# Altium project E17-12-VCU.PrjPcb
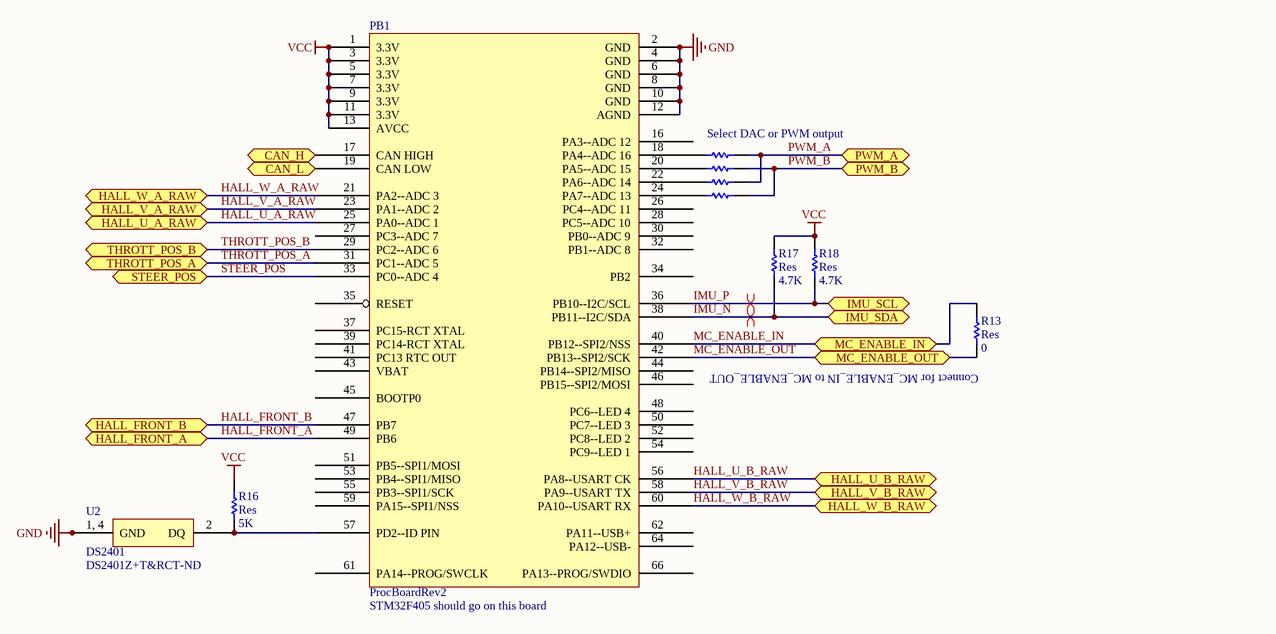
[diagram p0: E17-12-VCU-MCU.SchDoc]
1 sheet, 10 parts. Net scope: flat (ports and power ports of the same name join across sheets).
Board file: E17-12-VCU.PcbDoc

## Sheet E17-12-VCU-MCU.SchDoc
size A4

### Parts
PB1  ProcBoardRev2  [PROC_BOARD]
R13  Res  value 0  [2012[0805]]
R16  Res  value 5K  [2012[0805]]
R17  Res  value 4.7K  [2012[0805]]
R18  Res  value 4.7K  [2012[0805]]
R26  Res  [2012[0805]]  (value not drawn)
R27  Res  [2012[0805]]  (value not drawn)
R28  Res  [2012[0805]]  (value not drawn)
R29  Res  [2012[0805]]  (value not drawn)
U2  DS2401  Supplier Part Number 1: DS2401Z+T&RCT-ND  [SOT-223-3L]

### Ports
CAN_H, CAN_L, HALL_FRONT_A, HALL_FRONT_B, HALL_U_A_RAW, HALL_U_B_RAW, HALL_V_A_RAW, HALL_V_B_RAW, HALL_W_A_RAW, HALL_W_B_RAW, IMU_SCL, IMU_SDA, MC_ENABLE_IN, MC_ENABLE_OUT, PWM_A, PWM_B, STEER_POS, THROTT_POS_A, THROTT_POS_B

### Nets
GND: PB1.2(GND) PB1.4(GND) PB1.6(GND) PB1.8(GND) PB1.10(GND) PB1.12(AGND) U2.1(GND) U2.4(GND)
VCC: PB1.1(3.3V) PB1.3(3.3V) PB1.5(3.3V) PB1.7(3.3V) PB1.9(3.3V) PB1.11(3.3V) PB1.13(AVCC) R16.2 R17.2 R18.2
HALL_FRONT_A: PB1.49(PB6) ; port HALL_FRONT_A
HALL_FRONT_B: PB1.47(PB7) ; port HALL_FRONT_B
HALL_U_A_RAW: PB1.25(PA0--ADC_1) ; port HALL_U_A_RAW
HALL_U_B_RAW: PB1.56(PA8--USART_CK) ; port HALL_U_B_RAW
HALL_V_A_RAW: PB1.23(PA1--ADC_2) ; port HALL_V_A_RAW
HALL_V_B_RAW: PB1.58(PA9--USART_TX) ; port HALL_V_B_RAW
HALL_W_A_RAW: PB1.21(PA2--ADC_3) ; port HALL_W_A_RAW
HALL_W_B_RAW: PB1.60(PA10--USART_RX) ; port HALL_W_B_RAW
IMU_N: PB1.38(PB11--I2C/SDA) R17.1 ; port IMU_SDA
IMU_P: PB1.36(PB10--I2C/SCL) R18.1 ; port IMU_SCL
MC_ENABLE_IN: PB1.40(PB12--SPI2/NSS) R13.1 ; port MC_ENABLE_IN
MC_ENABLE_OUT: PB1.42(PB13--SPI2/SCK) R13.2 ; port MC_ENABLE_OUT
PWM_A: R26.1 R29.2 ; port PWM_A
PWM_B: R27.1 R28.2 ; port PWM_B
STEER_POS: PB1.33(PC0--ADC_4) ; port STEER_POS
THROTT_POS_A: PB1.31(PC1--ADC_5) ; port THROTT_POS_A
THROTT_POS_B: PB1.29(PC2--ADC_6) ; port THROTT_POS_B
NetPB1_17: PB1.17(CAN_HIGH) ; port CAN_H
NetPB1_18: PB1.18(PA4--ADC_16) R26.2
NetPB1_19: PB1.19(CAN_LOW) ; port CAN_L
NetPB1_20: PB1.20(PA5--ADC_15) R27.2
NetPB1_22: PB1.22(PA6--ADC_14) R29.1
NetPB1_24: PB1.24(PA7--ADC_13) R28.1
NetPB1_57: PB1.57(PD2--ID_PIN) R16.1 U2.2(DQ)

Not connected (* = marked no-connect by the designer): PB1 14(NC) 15(NC) 16(PA3--ADC_12) 26(PC4--ADC_11) 27(PC3--ADC_7) 28(PC5--ADC_10) 30(PB0--ADC_9) 32(PB1--ADC_8) 34(PB2) 35(RESET) 37(PC15-RCT_XTAL) 39(PC14-RCT_XTAL) 41(PC13_RTC_OUT) 43(VBAT) 44(PB14--SPI2/MISO) 45(BOOTP0) 46(PB15--SPI2/MOSI) 48(PC6--LED_4) 50(PC7--LED_3) 51(PB5--SPI1/MOSI) 52(PC8--LED_2) 53(PB4--SPI1/MISO) 54(PC9--LED_1) 55(PB3--SPI1/SCK) 59(PA15--SPI1/NSS) 61(PA14--PROG/SWCLK) 62(PA11--USB+) 63(NC) 64(PA12--USB-) 65(NC) 66(PA13--PROG/SWDIO) 67

### Layout directives
differential pair: IMU_N, IMU_P

### Notes on the sheet
- (near R26) Select DAC or PWM output
- (near R13) Connect for MC_ENABLE_IN to MC_ENABLE_OUT
- (near PB1) STM32F405 should go on this board
- (in symbol DS2401) 1, 4

### Library data of the parts
PB1 = ProcBoardRev2: Processor board that carries the STM32F072RB
R13 R16-R18 = Res: Surface Mount Resistor; Published: 8-Jun-2000; LatestRevisionDate: 17-Jul-2002; LatestRevisionNote: Re-released for DXP Platform.; PackageReference: AXIAL-0.5; Publisher: Altium Limited
R26-R29 = Res: Surface Mount Resistor; Value: 0; Published: 8-Jun-2000; LatestRevisionDate: 17-Jul-2002; LatestRevisionNote: Re-released for DXP Platform.; PackageReference: AXIAL-0.5; Publisher: Altium Limited
U2 = DS2401: IC SILICON SERIAL NUMBER SOT223; Supplier 1: Digi-Key